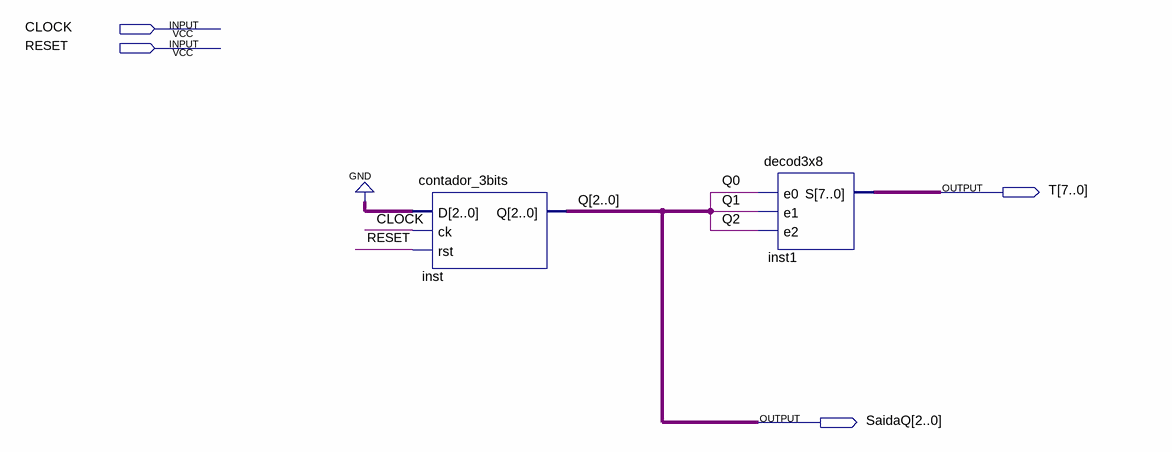
[diagram p0: schematic sheet]
// Quartus schematic temporizador.bdf as structural Verilog: 2 symbols, 4 pins
module temporizador (
  input  CLOCK,
  input  RESET,
  output [7:0] T,
  output [2:0] SaidaQ
);

  contador_3bits inst (.D(3'b000), .ck(CLOCK), .rst(RESET), .Q(SaidaQ));
  decod3x8 inst1 (.e0(SaidaQ[0]), .e1(SaidaQ[1]), .e2(SaidaQ[2]), .S(T));

  // Other names for the same wires on the sheet: Q[2:0] = SaidaQ; Q0 = SaidaQ[0]; Q1 = SaidaQ[1]; Q2 = SaidaQ[2]
endmodule
